# Altium schematic sheet [MP] Power Circuit.SchDoc
size 254 x 208 mm; SheetNumber: 7; SheetTotal: 8
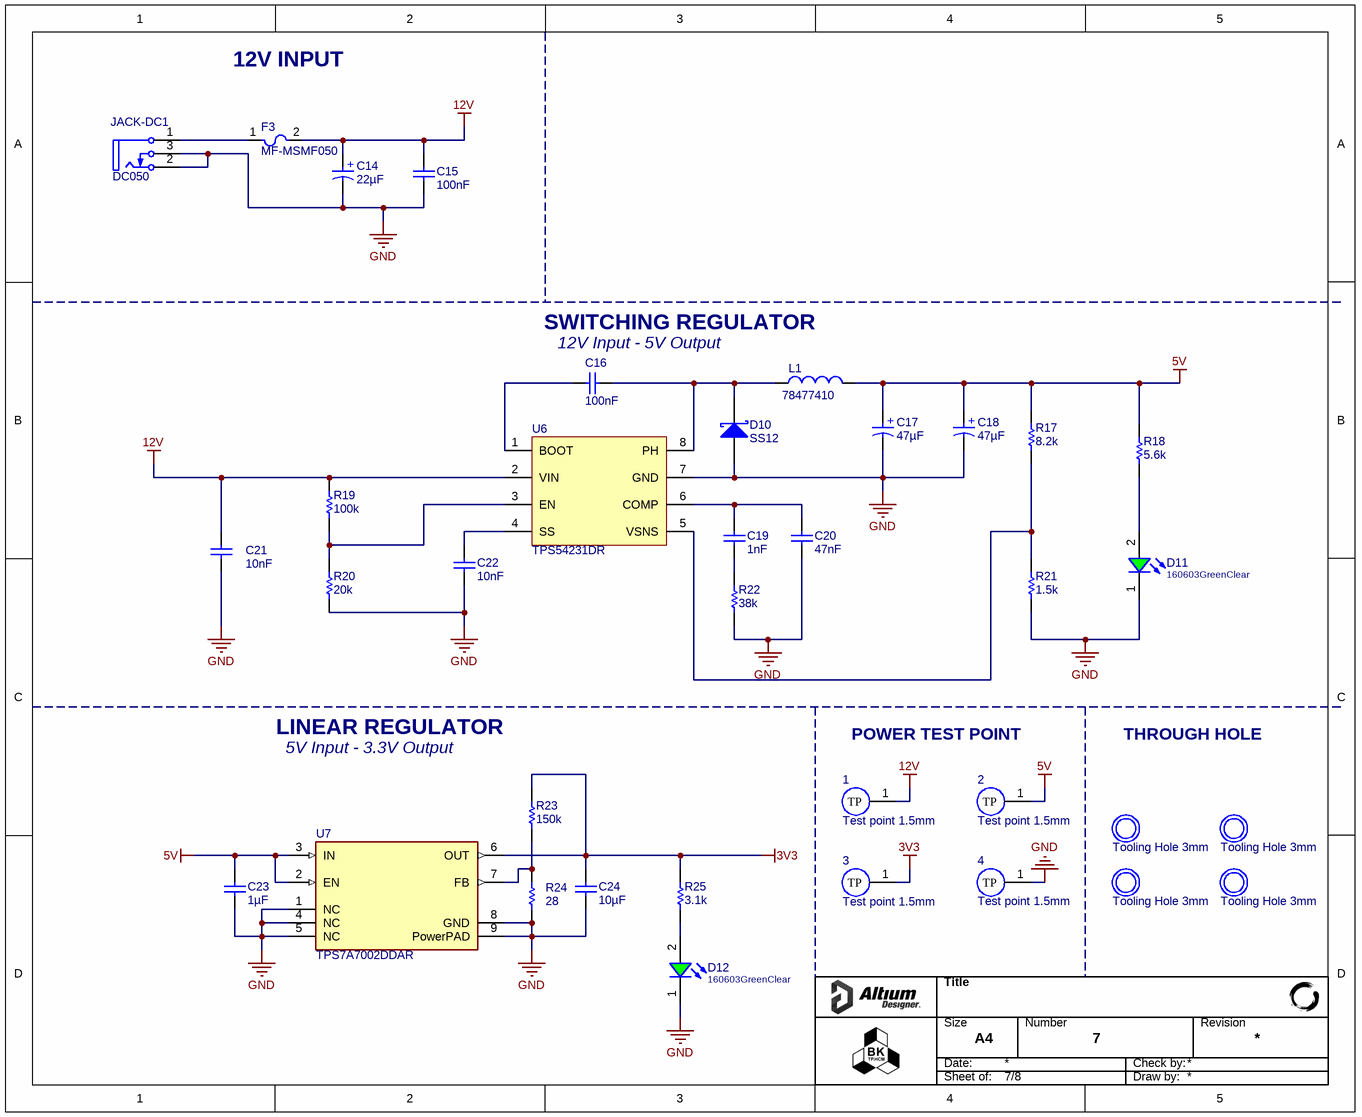
[diagram p0: [MP] Power Circuit.SchDoc]

## Parts
1  Test point 1.5mm  [Test point 1.5mm-Footprint-1]
2  Test point 1.5mm  [Test point 1.5mm-Footprint-1]
3  Test point 1.5mm  [Test point 1.5mm-Footprint-1]
4  Test point 1.5mm  [Test point 1.5mm-Footprint-1]
C14  value 22µF  [WCAP-ASLI_D4H5.5]  (hidden comment: 865080340003)
C15  value 100nF  [CAP_0603]  (hidden comment: 0106031041050)
C16  value 100nF  [CAP_0603]  (hidden comment: 0106031041050)
C17  value 47µF  [WCAP-ASLI_D5H5.5]  (hidden comment: 865080342006)
C18  value 47µF  [WCAP-ASLI_D5H5.5]  (hidden comment: 865080342006)
C19  value 1nF  [CAP_0603]  (hidden comment: 0106031020550)
C20  value 47nF  [CAP_0603]  (hidden comment: 0106034731050)
C21  value 10nF  [CAP_0603]  (hidden comment: 0106031030550)
C22  value 10nF  [CAP_0603]  (hidden comment: 0106031030550)
C23  value 1µF  [CAP_0603]  (hidden comment: 0106031051025)
C24  value 10µF  [CAP_0603]  (hidden comment: 0106031061010)
D10  SS12  [FAIR-DO-214AC-2_V]
D11  160603GreenClear  [WL-SMCW_0603_H=0.7mm]
D12  160603GreenClear  [WL-SMCW_0603_H=0.7mm]
F3  MF-MSMF050  [BOUR-MF-MSMF050-2_V]
H1  Tooling Hole 3mm  [3mm]  (no BOM)
H2  Tooling Hole 3mm  [3mm]  (no BOM)
H3  Tooling Hole 3mm  [3mm]  (no BOM)
H4  Tooling Hole 3mm  [3mm]  (no BOM)
JACK-DC1  DC050  [DC050-Footprint-1]
L1  78477410  [WE-PD2A_5848]
R17  value 8.2k  [0006038251]  (hidden comment: 0006038251)
R18  value 5.6k  [RES_0603]  (hidden comment: 0006035621)
R19  value 100k  [RES_0603]  (hidden comment: 0006031041)
R20  value 20k  [RES_0603]  (hidden comment: 0006032031)
R21  value 1.5k  [RES_0603]  (hidden comment: 0006031521)
R22  value 38k  [RES_0603]  (hidden comment: 0006033835)
R23  value 150k  [RES_0603]  (hidden comment: 0006031541)
R24  value 28  [RES_0603]  (hidden comment: 0006032801)
R25  value 3.1k  [RES_0603]  (hidden comment: 0006033121)
U6  TPS54231DR  [D0008A_L]
U7  TPS7A7002DDAR  [FP-DDA0008E-IPC_A]

## Nets
3V3: 3.1(TP) C24.2 R23.2 R25.2 U7.6(OUT)
5V: 2.1(TP) C17.1(P) C18.1(P) C23.2 L1.2 R17.2 R18.2 U7.2(EN) U7.3(IN)
12V: 1.1(TP) C14.1(P) C15.1 C21.2 F3.2 R19.2 U6.2(VIN)
GND: 4.1(TP) C14.2(N) C15.2 C17.2(N) C18.2(N) C20.1 C21.1 C22.1 C23.1 C24.1 D10.1(A) D11.1(K) D12.1(K) JACK-DC1.2(TIP) JACK-DC1.3(SHUNT) R20.1 R21.1 R22.1 R24.1 U6.7(GND) U7.1(NC) U7.4(NC) U7.5(NC) U7.8(GND) U7.9(PowerPAD)
NetC16_1: C16.1 U6.1(BOOT)
NetC16_2: C16.2 D10.2(K) L1.1 U6.8(PH)
NetC19_1: C19.1 R22.2
NetC19_2: C19.2 C20.2 U6.6(COMP)
NetC22_2: C22.2 U6.4(SS)
NetD11_2: D11.2(A) R18.1
NetD12_2: D12.2(A) R25.1
NetF3_1: F3.1 JACK-DC1.1(SLEEVE)
NetR17_1: R17.1 R21.2 U6.5(VSNS)
NetR19_1: R19.1 R20.2 U6.3(EN)
NetR23_1: R23.1 R24.2 U7.7(FB)

## Notes on the sheet
- 12V INPUT
- SWITCHING REGULATOR
- (near C16) 12V Input - 5V Output
- LINEAR REGULATOR
- POWER TEST POINT
- THROUGH HOLE
- 5V Input - 3.3V Output
- Title
- Size
- Date:
- A4
- Number
- Check by:
- Revision
- Sheet of:
- Draw by:
- (in symbol CMP-001-00129-2) +
- (in symbol CMP-001-00130-2) +

## Library data of the parts
1-4 = CMP-00028-00008-2: Test point, 1.5mm radius
C14 = CMP-001-00129-2: V-Chip, D4 x H5.5mm, 22uF, 16V; Manufacturer: Wurth Elektronik; Capacitance Tolerance: +/-20%; Leakage Current: 3.52uA; Endurance: 2000h; Ripple Current: 90mA; Dissipation Factor: 16%; Source: Al_Cap.SchLib; Supplier 2 URL: N/A; Supplier 1 Name: Mouser; Category: Aluminum Electrolytic Capacitors; Supplier 3 SN: N/A; Component Type: Standard; Packaging: Tape and Reel; Height: 5.5mm; Rated Voltage (DC): 16V; Supplier 1 URL: https://www.mouser.com/ProductDetail/Wurth-Elektronik/865080340003?qs=0KOYDY2FL2%252BowmC4S50IuQ%3D%3D; Design Item ID: 865080340003; Supplier 2 Name: Digi-Key; Operating Temperature Max: 105°C; Supplier 3 Name: thegioiic; Manufacturer Part Number: N/A; Operating Temperature Min: -55°C; Diameter: 4mm; Supplier 1 SN: 710-865080340003; Pins: 2; Supplier 3 URL: https://www.thegioiic.com/tu-nhom-smd-22uf-16v-4x5-4mm; Supplier 2 SN: N/A; Mount: Surface Mount
C15 C16 = CMP-001-00176-3: CAP, size 0603, 100 nF, 50 VDC, 10%; Manufacturer Part Number: CGA3E3X8R1H104K080AE; Manufacturer: TDK; Voltage Rating DC: 50 VDC; Supplier 3 URL: https://www.thegioiic.com/tu-gom-0603-100nf-0-1uf-50v; Case/Package: 0603; Tolerance: 10%; Operating Temperature Min: - 40 C; Pins: 2; Supplier 3 Part Number: N/A; ComponentLink1Description: Datasheet; Mount: SMD/SMT; Design Item ID: 0106031041050; Supplier 2 URL: https://www.digikey.com/en/products/detail/tdk-corporation/cga3e3x8r1h104k080ae/5809262; Packaging: Tape and Reel; Component Type: Standard; ComponentLink1URL: https://product.tdk.com/system/files/dam/doc/product/capacitor/ceramic/mlcc/catalog/mlcc_automotive_soft_en.pdf?ref_disty=mouser; Supplier 1 URL: https://www.mouser.com/ProductDetail/TDK/CGA3E3X8R1H104K080AE?qs=nQSIdc08i%252Bd8g3IRRgU2bw%3D%3D&utm_source=mouser-refine-download&utm_medium=file&utm_campaign=CGA3E3X8R1H104K080AE&utm_content=TDK; Source: Capacitor_0603_10_percent.SchLib; Operating Temperature Max: + 85 C; Supplier 2 Part Number: 445-173697-2-ND; LCSC Part #: C14663; Supplier 1 Part Number: 810-CGA3E3X8R1H104KA
C17 C18 = CMP-001-00130-2: V-Chip, D5 x H5.5mm, 47uF, 16V; Manufacturer: Wurth Elektronik; Endurance: 2000h; Capacitance Tolerance: +/-20%; Dissipation Factor: 16%; Ripple Current: 195mA; Leakage Current: 7.52uA; Supplier 3 SN: N/A; Diameter: 5mm; Component Type: Standard; Operating Temperature Max: 105°C; Source: Al_Cap.SchLib; Operating Temperature Min: -55°C; Supplier 1 Name: Mouser; Design Item ID: 865080342006; Rated Voltage (DC): 16V; Category: Aluminum Electrolytic Capacitors; Supplier 2 URL: N/A; Height: 5.5mm; Supplier 2 SN: N/A; Packaging: Tape and Reel; Supplier 2 Name: Digi-Key; Supplier 3 URL: https://www.thegioiic.com/tu-nhom-smd-47uf-16v-5x5-4mm; Mount: Surface Mount; Pins: 2; Supplier 3 Name: thegioiic; Manufacturer Part Number: N/A; Supplier 1 SN: 710-865080262015; Supplier 1 URL: https://www.mouser.com/ProductDetail/Wurth-Elektronik/865080262015?qs=0KOYDY2FL2%2Ffe5w2MssUoQ%3D%3D
C19 = CMP-001-00172-3: CAP, size 0603, 1 nF, 50 VDC, 5%; Manufacturer: TDK; Manufacturer Part Number: CGA3E2NP01H102J080AA; Voltage Rating DC: 50 VDC; Supplier 2 URL: https://www.digikey.com/en/products/detail/tdk-corporation/cga3e2np01h102j080aa/3949621; Mount: SMD/SMT; Supplier 3 URL: N/A; Operating Temperature Min: - 40 C; Supplier 1 Part Number: 810-CGA3E2NP01H102JA; Source: Capacitor_0603_5_percent.SchLib; Component Type: Standard; LCSC Part #: N/A; Supplier 3 Part Number: N/A; Pins: 2; Case/Package: 0603; Packaging: Tape and Reel; Supplier 1 URL: https://www.mouser.com/ProductDetail/TDK/CGA3E2NP01H102J080AA?qs=xLDY6iXSiQaozl9q8leaqQ%3D%3D&utm_source=mouser-refine-download&utm_medium=file&utm_campaign=CGA3E2NP01H102J080AA&utm_content=TDK; ComponentLink1URL: https://product.tdk.com/system/files/dam/doc/product/capacitor/ceramic/mlcc/catalog/mlcc_automotive_hightemp_en.pdf?ref_disty=mouser; Supplier 2 Part Number: 445-12385-2-ND; Tolerance: 5%; Design Item ID: 0106031020550; Operating Temperature Max: + 85 C; ComponentLink1Description: Datasheet
C20 = CMP-001-00209-3: CAP, size 0603, 47 nF, 50 VDC, 10%; Manufacturer Part Number: CGA3E2X7R1H473K080AA; Manufacturer: TDK; Voltage Rating DC: 50 VDC; Operating Temperature Min: - 40 C; ComponentLink1URL: https://product.tdk.com/system/files/dam/doc/product/capacitor/ceramic/mlcc/catalog/mlcc_automotive_general_en.pdf?ref_disty=mouser; Supplier 1 URL: https://www.mouser.com/ProductDetail/TDK/CGA3E2X7R1H473K080AA?qs=NRhsANhppD%252BXNlr9LoLgTw%3D%3D&utm_source=mouser-refine-download&utm_medium=file&utm_campaign=CGA3E2X7R1H473K080AA&utm_content=TDK; Design Item ID: 0106034731050; ComponentLink1Description: Datasheet; Supplier 3 Part Number: N/A; Mount: SMD/SMT; Case/Package: 0603; Supplier 3 URL: N/A; Supplier 2 URL: https://www.digikey.com/en/products/detail/tdk-corporation/cga3e2x7r1h473k080aa/2443142; Operating Temperature Max: + 85 C; Supplier 1 Part Number: 810-CGA3E2X7R1H473K; Source: Capacitor_0603_10_percent.SchLib; Tolerance: 10%; Component Type: Standard; Packaging: Tape and Reel; Pins: 2; LCSC Part #: N/A; Supplier 2 Part Number: 445-5664-2-ND
C21 C22 = CMP-001-00174-3: CAP, size 0603, 10 nF, 50 VDC, 5%; Manufacturer: TDK; Manufacturer Part Number: CGA3E2C0G1H103J080AE; Voltage Rating DC: 50 VDC; Design Item ID: 0106031030550; ComponentLink1URL: https://product.tdk.com/system/files/dam/doc/product/capacitor/ceramic/mlcc/catalog/mlcc_automotive_soft_en.pdf?ref_disty=mouser; Supplier 3 Part Number: N/A; Tolerance: 5%; Supplier 2 URL: https://www.digikey.com/en/products/detail/tdk-corporation/cga3e2c0g1h103j080ae/11697946; Supplier 3 URL: N/A; Pins: 2; Mount: SMD/SMT; Operating Temperature Max: + 85 C; ComponentLink1Description: Datasheet; Case/Package: 0603; Supplier 2 Part Number: 445-CGA3E2C0G1H103J080AETR-ND; Packaging: Tape and Reel; Supplier 1 URL: https://www.mouser.com/ProductDetail/TDK/CGA3E2C0G1H103J080AE?qs=P1JMDcb91o6ZkMITrWTUZQ%3D%3D&utm_source=mouser-refine-download&utm_medium=file&utm_campaign=CGA3E2C0G1H103J080AE&utm_content=TDK; Component Type: Standard; LCSC Part #: N/A; Source: Capacitor_0603_5_percent.SchLib; Supplier 1 Part Number: 810-CGA3E2C0G1H103J8; Operating Temperature Min: - 40 C
C23 = CMP-001-00178-3: CAP, size 0603, 1 uF, 25 VDC, 10%; Manufacturer: Samsung Electro-Mechanics; Manufacturer Part Number: CL10A105KA8NNNC; Voltage Rating DC: 25 VDC; Pins: 2; Component Type: Standard; Supplier 3 Part Number: N/A; ComponentLink1Description: Datasheet; Supplier 2 Part Number: 1276-1102-2-ND; Case/Package: 0603; Supplier 1 URL: https://www.mouser.vn/ProductDetail/Samsung-Electro-Mechanics/CL10A105KA8NNNC?qs=hqM3L16%252BxldY%252BnK4KzDJVg%3D%3D&utm_source=mouser-refine-download&utm_medium=file&utm_campaign=CL10A105KA8NNNC&utm_content=Samsung-Electro-Mechanics; Packaging: Tape and Reel; ComponentLink1URL: https://www.mouser.vn/datasheet/2/585/MLCC-1837944.pdf; Operating Temperature Min: - 40 C; Supplier 3 URL: https://www.thegioiic.com/tu-gom-0603-1uf-25v; Operating Temperature Max: + 85 C; Tolerance: 10%; LCSC Part #: N/A; Design Item ID: 0106031051025; Source: Capacitor_0603_10_percent.SchLib; Supplier 2 URL: https://www.digikey.com/en/products/detail/samsung-electro-mechanics/cl10a105ka8nnnc/3886760; Mount: SMD/SMT; Supplier 1 Part Number: 187-CL10A105KA8NNNC
C24 = CMP-001-00181-3: CAP, size 0603, 10 uF, 10 VDC, 10%; Manufacturer: Samsung Electro-Mechanics; Manufacturer Part Number: CL10A106KP8NNNC; Voltage Rating DC: 10 VDC; Supplier 2 Part Number: 1276-1192-2-ND; Pins: 2; Design Item ID: 0106031061010; Supplier 2 URL: https://www.digikey.com/en/products/detail/samsung-electro-mechanics/cl10a106kp8nnnc/3886850; Source: Capacitor_0603_10_percent.SchLib; Component Type: Standard; Operating Temperature Min: - 40 C; Packaging: Tape and Reel; Supplier 3 Part Number: N/A; Supplier 1 URL: https://www.mouser.vn/ProductDetail/Samsung-Electro-Mechanics/CL10A106KP8NNNC?qs=X6jEic%2FHinAlyfRHj7fKwg%3D%3D; LCSC Part #: C19702; Supplier 3 URL: https://www.thegioiic.com/tu-gom-0603-10uf-25v; ComponentLink1Description: Datasheet; Operating Temperature Max: + 85 C; ComponentLink1URL: https://www.mouser.vn/datasheet/2/585/MLCC-1837944.pdf; Mount: SMD/SMT; Case/Package: 0603; Supplier 1 Part Number: 187-CL10A106KP8NNNC; Tolerance: 10%
D10 = CMP-004-00016-3: Schottky Rectifier, 20 V, 1 A, -65 to 125 degC, 2-Pin DO-214AC, RoHS, Tape and Reel; Manufacturer: Fairchild; Forward Voltage: 500mV; Peak Reverse Current: 200uA; Max Surge Current: 40A; Min Operating Temperature: -65°C; Packaging: TapeandReel; Datasheet URL: https://www.fairchildsemi.com/datasheets/SS/SS12.pdf; Datasheet Version: Rev. 1.9, 01/2015; Package URL: https://www.fairchildsemi.com/package-drawings/DO/DO214AC.pdf; Package Description: 2-Pin Surface Mount Device, Body 4.375 x 2.725 mm; Manufacturer URL: https://www.fairchildsemi.com/; Mounting Technology: SM; Case/Package: SMA; RoHS Compliant: True; Package Quantity: 7500; Pins: 2; Max Operating Temperature: 125°C; Package Reference: DO-214AC-2
D11 D12 = CMP-004-00034-2: WL-SMCW SMT Mono-color Chip LED Waterclear, size 0603, Green, 3.2V, 140deg; Type: Clear; Size: 0603; Supplier 3 SN: N/A; Supplier 3 URL: https://www.thegioiic.com/led-xanh-la-0603-dan-smd-trong-suot; ComponentLink4Description: Supplier 3 URL; ComponentLink3URL: https://www.digikey.com/en/products/detail/liteon/LTST-C191KGKT/386835; Pins: 2; Supplier 1 SN: 710-150060GS75000; Source: WL-SMCW_0603.SchLib; Supplier 1 Name: Mouser; ComponentLink2URL: https://www.mouser.vn/ProductDetail/Wurth-Elektronik/150060GS75000?qs=LlUlMxKIyB0UYkq5lDO8nA%3D%3D; ComponentLink1URL: N/A; Component Type: Standard; ComponentLink3Description: Supplier 2 URL; Supplier 2 SN: 160-1446-2-ND; Value: Green, 3.2V; Design Item ID: 160603GreenClear; ComponentLink2Description: Supplier 1 URL; Supplier 2 URL: https://www.digikey.com/en/products/detail/liteon/LTST-C191KGKT/386835; ComponentLink4URL: https://www.thegioiic.com/led-xanh-la-0603-dan-smd-trong-suot; ComponentLink1Description: Datasheet link; Supplier 3 Name: ICDayRoi; Supplier 1 URL: https://www.mouser.vn/ProductDetail/Wurth-Elektronik/150060GS75000?qs=LlUlMxKIyB0UYkq5lDO8nA%3D%3D; Supplier 2 Name: Digi-Key; Color: Green
F3 = CMP-005-00000-5: PTC Resettable Fuse, 15 V, 500 mA, -40 to 85 degC, 2-Pin SMD, RoHS, Tape and Reel; Manufacturer: Bourns; Current Rating: 100A; Min Operating Temperature: -40°C; Packaging: TapeandReel; Datasheet Version: Rev. AG, 08/2016; Case/Package: MF-MSMF050-2; Package Reference: MF-MSMF050-2; Datasheet URL: http://www.bourns.com/data/global/pdfs/mfmsmf.pdf; RoHS Compliant: False; Package Description: 2-Pin Surface Mount Device, Body 4.55 x 3.24 mm; Mounting Technology: SM; Max Operating Temperature: 85°C
H1-H4 = CMP-034-000004-2: Source: Hole.SchLib; Design Item ID: Tooling Hole 3mm; Pin Count: 0; Component Type: Standard (No BOM)
JACK-DC1 = CMP-002-00071-2: DinxDout 2.1mm-55mm Jack Power DC Receptacle; Gender: Female; Voltage Rating: 16V; Max Current Rating: 2.5A; Connector Type: DCJack; Mounting Technology: SMT; Case/Package: DC050; RoHS Compliant: Yes; Pins: 3
L1 = CMP-006-00021-3: General Purpose Inductor; RoHS Compliant: Yes
R17 = CMP-009-00673-2: RES, size 0603, 8.2 KOhm, 1/10 W, 1%; Pins: 2; Case/Package: 0603; Mounting Technology: SMT
R18 = CMP-009-00362-5: RES, size 0603, 5.6 KOhm, 1/10 W, 1%; Manufacturer Part Number: OEM; Rated Power: 1/10 W; Packaging: Tape and Reel; Design Item ID: 0006035621; Supplier 1 URL: https://www.mouser.vn/ProductDetail/Panasonic/ERJ-UP3F5601V?qs=sGAEpiMZZMvdGkrng054twq3eZrCFN89ezYxgAsnxBTZYD17cS%252B65A%3D%3D; Supplier 1 Part Number: 667-ERJ-UP3F5601V; Operating Temperature Max: + 85 C; ComponentLink1Description: Datasheet; Operating Temperature Min: - 40 C; Supplier 2 URL: https://www.digikey.com/en/products/detail/panasonic-electronic-components/ERJ-UP3F5601V/12092890; Component Type: Standard; LCSC Part #: N/A; Source: Resistor_0603.SchLib; Supplier 3 Part Number: N/A; Manufacturer: OEM; ComponentLink1URL: https://api.pim.na.industrial.panasonic.com/file_stream/main/fileversion/4484; Mount: SMD/SMT; Supplier 3 URL: N/A; Tolerance: 1%; Pins: 2; Supplier 2 Part Number: 10-ERJ-UP3F5601VTR-ND 10-ERJ-UP3F5601VCT-ND 10-ERJ-UP3F5601VDKR-ND; Case/Package: 0603
R19 = CMP-009-00188-5: RES, size 0603, 100 KOhm, 1/10 W, 1%; Manufacturer Part Number: OEM; Rated Power: 1/10 W; Packaging: Tape and Reel; Supplier 1 Part Number: 603-SR0603FR-7T100KL; Design Item ID: 0006031041; Pins: 2; Operating Temperature Min: - 40 C; Supplier 3 URL: N/A; ComponentLink1Description: Datasheet; Supplier 3 Part Number: N/A; Source: Resistor_0603.SchLib; Operating Temperature Max: + 85 C; Supplier 1 URL: https://www.mouser.vn/ProductDetail/YAGEO/SR0603FR-7T100KL?qs=sGAEpiMZZMvdGkrng054tz1y1XEHv7sNa%252BA%2F4WiDMf7aGw4zRBb%2FFQ%3D%3D; Case/Package: 0603; Supplier 2 URL: https://www.digikey.com/en/products/detail/yageo/SR0603FR-7T100KL/9373095; Manufacturer: OEM; Tolerance: 1%; ComponentLink1URL: https://www.yageo.com/upload/media/product/productsearch/datasheet/rchip/PYu-SR_20105_RoHS_L_10.pdf; Component Type: Standard; LCSC Part #: N/A; Mount: SMD/SMT; Supplier 2 Part Number: YAG5821TR-ND YAG5821CT-ND YAG5821DKR-ND
R20 = CMP-009-00266-5: RES, size 0603, 20 KOhm, 1/10 W, 1%; Manufacturer Part Number: RC0603FR-0720KL; Manufacturer: YAGEO; Rated Power: 1/10 W; Operating Temperature Min: - 40 C; Packaging: Tape and Reel; Source: Resistor_0603.SchLib; Mount: SMD/SMT; Supplier 1 Part Number: 603-RC0603FR-0720KL; Tolerance: 1%; Supplier 3 URL: N/A; Component Type: Standard; Supplier 2 Part Number: 311-20.0KHRTR-ND; Operating Temperature Max: + 85 C; Design Item ID: 0006032031; LCSC Part #: C105575; Pins: 2; Supplier 2 URL: https://www.digikey.com/en/products/detail/yageo/RC0603FR-0720KL/727040?s=N4IgTCBcDaIEoGEAMA2JBmAYnAtEg7GEgNIAyIAugL5A; Supplier 3 Part Number: N/A; ComponentLink1URL: https://www.mouser.com/datasheet/2/447/YAGEO_PYu_RC_Group_51_RoHS_L_12-3313492.pdf; Supplier 1 URL: https://www.mouser.com/ProductDetail/YAGEO/RC0603FR-0720KL?qs=VU8sRB4EgwCsxfrjtEIKPQ%3D%3D; ComponentLink1Description: Datasheet; Case/Package: 0603
R21 = CMP-009-00234-5: RES, size 0603, 1.5 KOhm, 1/10 W, 1%; Manufacturer: OEM; Rated Power: 1/10 W; Packaging: Tape and Reel; ComponentLink1Description: Datasheet; Component Type: Standard; Design Item ID: 0006031521; Supplier 2 URL: https://www.digikey.com/en/products/detail/yageo/RC0603FR-071R5L/5918292; Operating Temperature Min: - 40 C; Mount: SMD/SMT; Source: Resistor_0603.SchLib; Supplier 2 Part Number: 13-RC0603FR-071R5LTR-ND; Supplier 3 URL: N/A; Case/Package: 0603; Supplier 1 URL: https://www.mouser.vn/ProductDetail/ROHM-Semiconductor/SFR03EZPF1501?qs=byeeYqUIh0NryWvnzlukLQ%3D%3D; Supplier 1 Part Number: 755-SFR03EZPF1501; ComponentLink1URL: N/A; Tolerance: 1%; Pins: 2; LCSC Part #: N/A; Supplier 3 Part Number: N/A; Manufacturer Part Number: OEM; Operating Temperature Max: + 85 C
R22 = CMP-009-00329-5: RES, size 0603, 38 KOhm, 1/10 W, 5%; Manufacturer: OEM; Rated Power: 1/10 W; Supplier 1 Part Number: N/A; Source: Resistor_0603.SchLib; Operating Temperature Min: - 40 C; Supplier 2 URL: N/A; LCSC Part #: N/A; Supplier 2 Part Number: N/A; Case/Package: 0603; Packaging: Tape and Reel; Supplier 1 URL: N/A; Manufacturer Part Number: OEM; Component Type: Standard; Supplier 3 Part Number: N/A; Pins: 2; ComponentLink1Description: Datasheet; Mount: SMD/SMT; Operating Temperature Max: + 85 C; ComponentLink1URL: N/A; Supplier 3 URL: N/A; Tolerance: 5%; Design Item ID: 0006033835
R23 = CMP-009-00236-5: RES, size 0603, 150 KOhm, 1/10 W, 1%; Manufacturer Part Number: OEM; Rated Power: 1/10 W; Tolerance: 1%; Supplier 1 Part Number: 71-RCS0603150KFKEA; Operating Temperature Max: + 85 C; Mount: SMD/SMT; ComponentLink1URL: https://www.vishay.com/docs/20065/rcse3.pdf; Component Type: Standard; Supplier 3 URL: N/A; Source: Resistor_0603.SchLib; Manufacturer: OEM; Operating Temperature Min: - 40 C; LCSC Part #: N/A; Supplier 1 URL: https://www.mouser.vn/ProductDetail/Vishay-Dale/RCS0603150KFKEA?qs=sGAEpiMZZMvdGkrng054t9clqp6gtJJdfH%252BXqq0SHQPcFX9vWgSfoA%3D%3D; Supplier 2 URL: https://www.digikey.com/en/products/detail/vishay-dale/RCS0603150KFKEA/5868719; Pins: 2; Case/Package: 0603; Packaging: Tape and Reel; Supplier 3 Part Number: N/A; ComponentLink1Description: Datasheet; Supplier 2 Part Number: 541-RCS0603150KFKEATR-ND 541-RCS0603150KFKEACT-ND 541-RCS0603150KFKEADKR-ND; Design Item ID: 0006031541
R24 = CMP-009-00300-5: RES, size 0603, 28 Ohm, 1/10 W, 1%; Manufacturer: OEM; Rated Power: 1/10 W; Case/Package: 0603; ComponentLink1Description: Datasheet; Pins: 2; Supplier 1 URL: https://www.mouser.vn/ProductDetail/Panasonic/ERJ-PA3F28R0V?qs=sGAEpiMZZMvdGkrng054t6%2FAfIpq60YD5y71hYQ1i3rQySijSHDQhg%3D%3D; Component Type: Standard; ComponentLink1URL: https://api.pim.na.industrial.panasonic.com/file_stream/main/fileversion/4484; Supplier 3 URL: N/A; Tolerance: 1%; Supplier 3 Part Number: N/A; Manufacturer Part Number: OEM; Operating Temperature Max: + 85 C; Packaging: Tape and Reel; Operating Temperature Min: - 40 C; Supplier 1 Part Number: 667-ERJ-PA3F28R0V; Design Item ID: 0006032801; Mount: SMD/SMT; Supplier 2 URL: https://www.digikey.com/en/products/detail/panasonic-electronic-components/ERJ-UP3F28R0V/12092047; LCSC Part #: N/A; Source: Resistor_0603.SchLib; Supplier 2 Part Number: 10-ERJ-UP3F28R0VTR-ND
R25 = CMP-009-00309-5: RES, size 0603, 3.1  KOhm, 1/10 W, 1%; Manufacturer: OEM; Rated Power: 1/10 W; Packaging: Tape and Reel; Operating Temperature Min: - 40 C; Case/Package: 0603; Source: Resistor_0603.SchLib; Tolerance: 1%; Operating Temperature Max: + 85 C; ComponentLink1Description: Datasheet; Mount: SMD/SMT; Manufacturer Part Number: OEM; Supplier 2 Part Number: MCT06030C3101FP500-ND; Supplier 1 URL: https://www.mouser.vn/ProductDetail/Bourns/CHP0603-FX-3011ELF?qs=gZXFycFWdAOzN1n7XWkwdg%3D%3D; ComponentLink1URL: N/A; Pins: 2; Component Type: Standard; LCSC Part #: N/A; Design Item ID: 0006033121; Supplier 3 Part Number: N/A; Supplier 3 URL: N/A; Supplier 1 Part Number: 652-CHP0603FX3011ELF; Supplier 2 URL: https://www.digikey.com/en/products/detail/vishay-beyschlag-draloric-bc-components/MCT06030C3101FP500/8124767
U6 = CMP-019-00051-4: Switching Regulator, Current-mode, 2A, 570kHz Switching Freq-Max, PDSO8; Max Supply Voltage: 28V; Frequency: 740kHz; Max Operating Temperature: 150°C; Locally Supplier URL: https://www.thegioiic.com/tps54231dr-ic-dieu-chinh-giam-ap-2a-8-soic; Min Operating Temperature: -40°C; Pins: 8; Case/Package: SOP; RoHS Compliant: Yes; Locally Supplier Name: Thegioiic
U7 = CMP-019-00056-2: Adjustable Positive LDO Regulator, 0.5V Min, 5V Max, 0.6V Dropout, CMOS, PDSO8; Pins: 8; Case/Package: HLSOP; RoHS Compliant: Yes